# EAGLE design mega_meco (EAGLE 7.5.0)
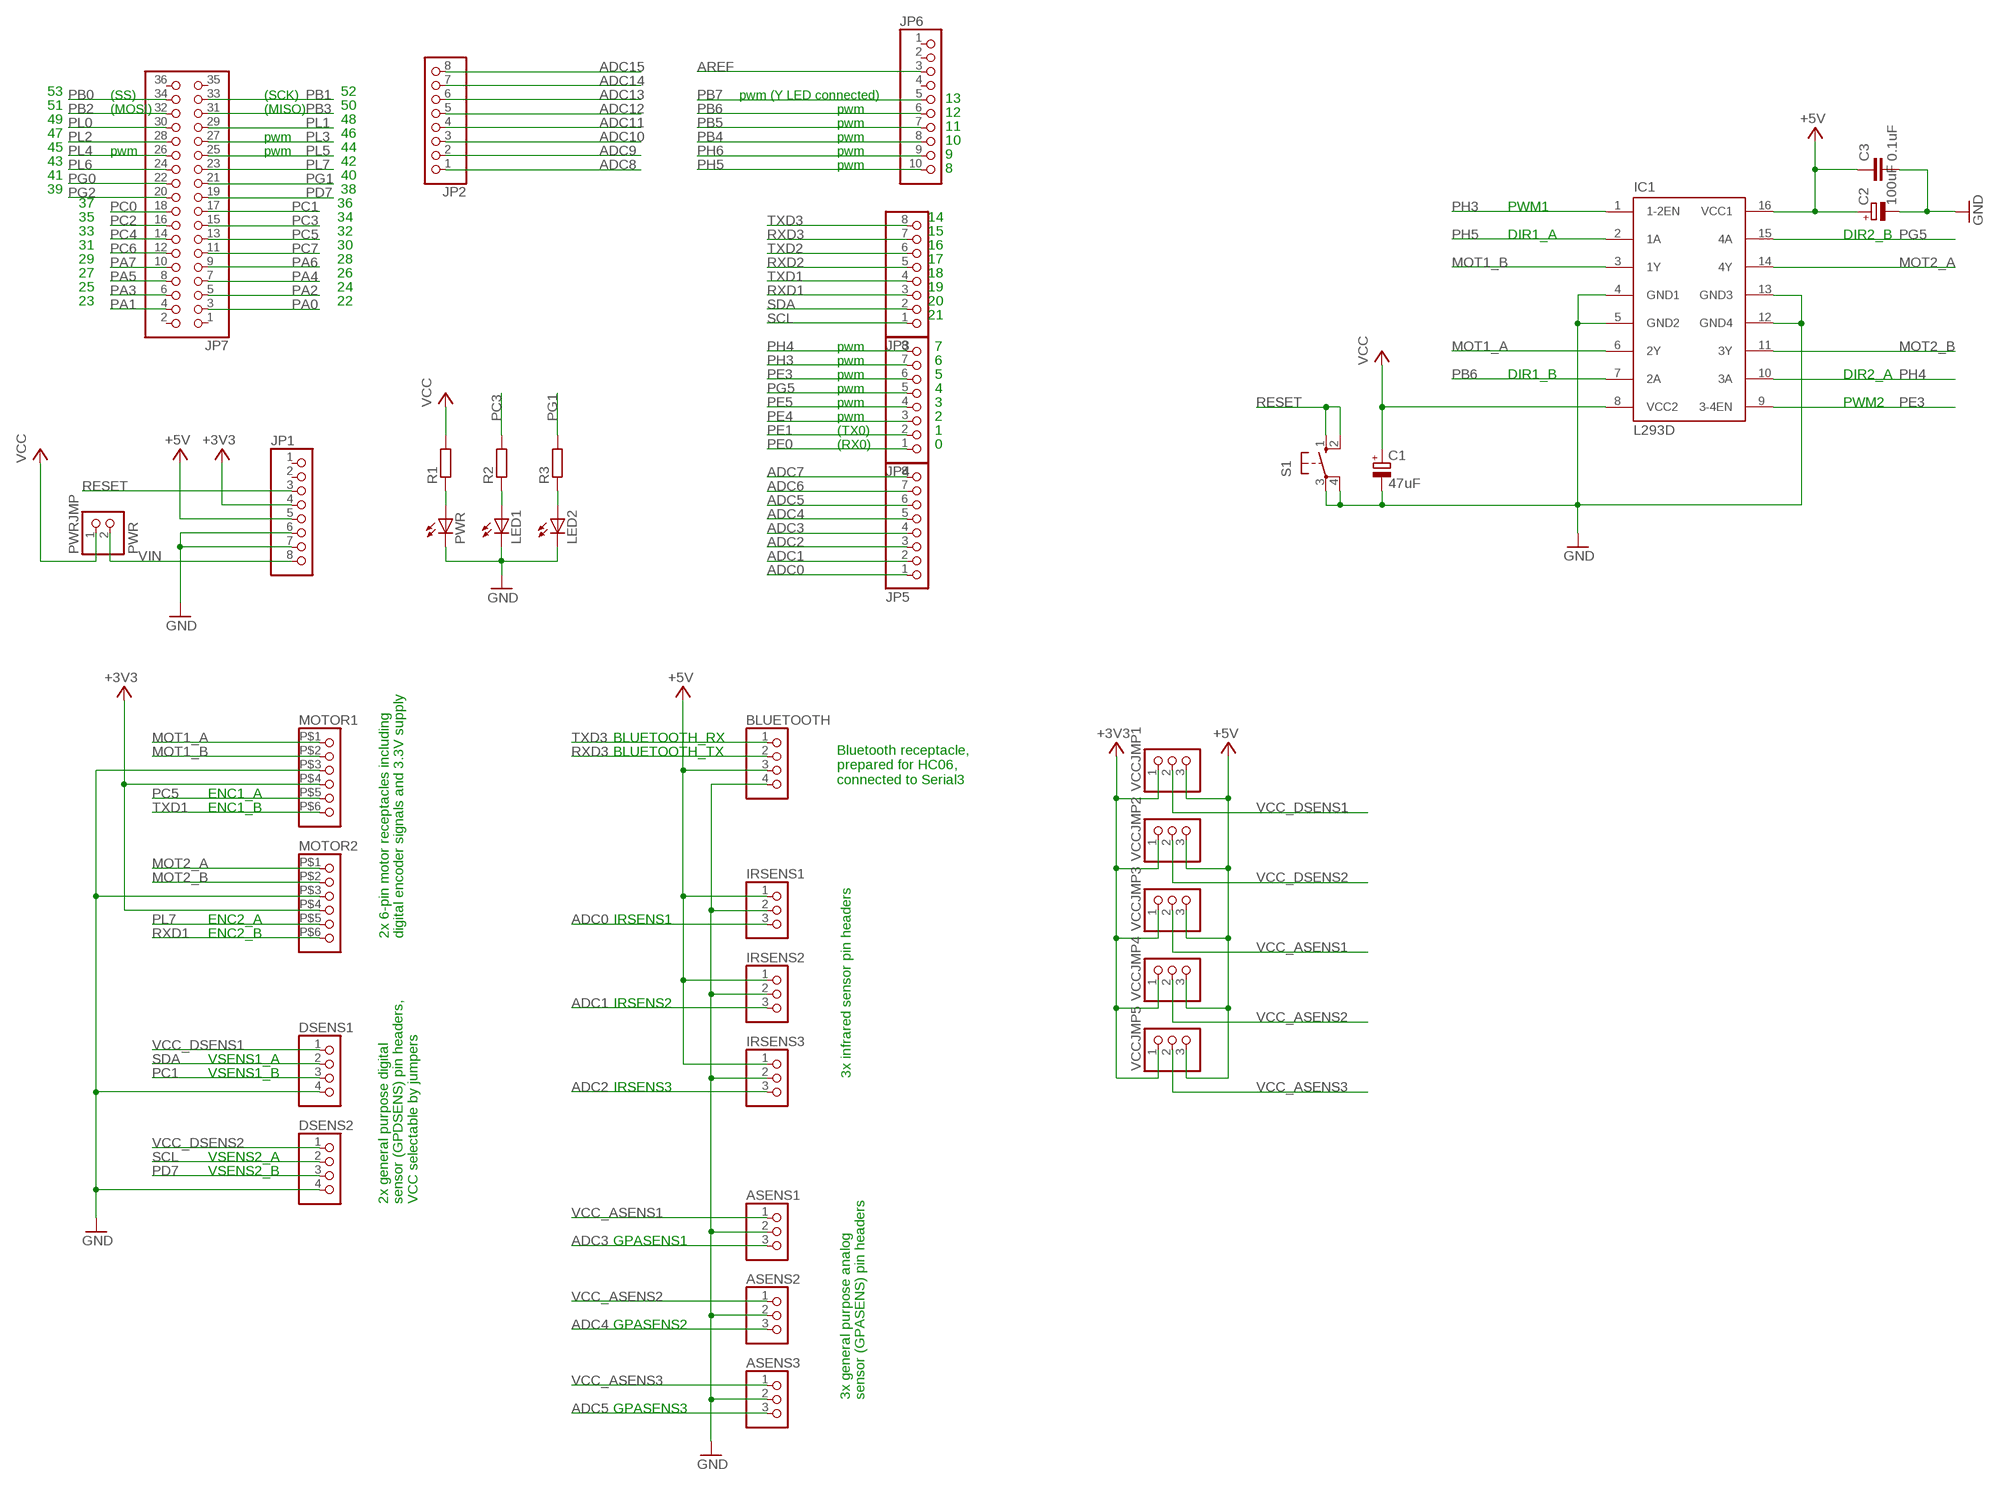
[diagram p0: schematic, sheet 1]

## Parts
ASENS1  PINHD-1X3  [1X03]
ASENS2  PINHD-1X3  [1X03]
ASENS3  PINHD-1X3  [1X03]
BLUETOOTH  PINHD-1X4  [1X04]
C1  47uF  CPOL-EUE2-5  [E2-5]
C2  100uF  CPOL-EUE2-5  [E2-5]
C3  0.1uF  C-EU025-025X050  [C025-025X050]
DSENS1  PINHD-1X4  [1X04]
DSENS2  PINHD-1X4  [1X04]
IC1  L293D  L293E  [DIL16]
IRSENS1  PINHD-1X3  [1X03]
IRSENS2  PINHD-1X3  [1X03]
IRSENS3  PINHD-1X3  [1X03]
JP1  PINHD-1X8  [1X08]
JP2  PINHD-1X8  [1X08]
JP3  PINHD-1X8  [1X08]
JP4  PINHD-1X8  [1X08]
JP5  PINHD-1X8  [1X08]
JP6  PINHD-1X10  [1X10]
JP7  PINHD-2X18  [2X18]
LED1  LED3MM  [LED3MM]
LED2  LED3MM  [LED3MM]
MOTOR1  PINHD-1X6-2.5MM  [1X06-2.5MM]
MOTOR2  PINHD-1X6-2.5MM  [1X06-2.5MM]
PWR  LED5MM  [LED5MM]
PWRJMP  PWR  PINHD-1X2  [1X02]
R1  R-EU_0204/5  [0204/5]
R2  R-EU_0204/5  [0204/5]
R3  R-EU_0204/5  [0204/5]
S1  10-XX  [B3F-10XX]
VCCJMP1  PINHD-1X3  [1X03]
VCCJMP2  PINHD-1X3  [1X03]
VCCJMP3  PINHD-1X3  [1X03]
VCCJMP4  PINHD-1X3  [1X03]
VCCJMP5  PINHD-1X3  [1X03]

## Nets
+3V3 [power]: JP1.4 MOTOR1.P$4 MOTOR2.P$4 VCCJMP1.1 VCCJMP2.1 VCCJMP3.1 VCCJMP4.1 VCCJMP5.1
+5V [power usb]: BLUETOOTH.3 C2.+ C3.1 IC1.16(VCC1) IRSENS1.1 IRSENS2.1 IRSENS3.1 JP1.5 VCCJMP1.3 VCCJMP2.3 VCCJMP3.3 VCCJMP4.3 VCCJMP5.3
ADC0: IRSENS1.3 JP5.1
ADC1: IRSENS2.3 JP5.2
ADC2: IRSENS3.3 JP5.3
ADC3: ASENS1.3 JP5.4
ADC4: ASENS2.3 JP5.5
ADC5: ASENS3.3 JP5.6
ADC6: JP5.7
ADC7: JP5.8
ADC8: JP2.1
ADC9: JP2.2
ADC10: JP2.3
ADC11: JP2.4
ADC12: JP2.5
ADC13: JP2.6
ADC14: JP2.7
ADC15: JP2.8
AREF: JP6.3
GND [gnd]: ASENS1.2 ASENS2.2 ASENS3.2 BLUETOOTH.4 C1.- C2.- C3.2 DSENS1.4 DSENS2.4 IC1.4(GND1) IC1.5(GND2) IC1.12(GND4) IC1.13(GND3) IRSENS1.2 IRSENS2.2 IRSENS3.2 JP1.6 JP1.7 LED1.K(C) LED2.K(C) MOTOR1.P$3 MOTOR2.P$3 PWR.K(C) S1.3(P) S1.4(P1)
MOT1_A: IC1.6(2Y) MOTOR1.P$1
MOT1_B: IC1.3(1Y) MOTOR1.P$2
MOT2_A: IC1.14(4Y) MOTOR2.P$1
MOT2_B: IC1.11(3Y) MOTOR2.P$2
N$1: PWR.A R1.1
N$2: LED1.A R2.1
N$3: LED2.A R3.1
PA0: JP7.3
PA1: JP7.4
PA2: JP7.5
PA3: JP7.6
PA4: JP7.7
PA5: JP7.8
PA6: JP7.9
PA7: JP7.10
PB0: JP7.34
PB1: JP7.33
PB2: JP7.32
PB3: JP7.31
PB4: JP6.8
PB5: JP6.7
PB6: IC1.7(2A) JP6.6
PB7: JP6.5
PC0: JP7.18
PC1: DSENS1.3 JP7.17
PC2: JP7.16
PC3: JP7.15 R2.2
PC4: JP7.14
PC5: JP7.13 MOTOR1.P$5
PC6: JP7.12
PC7: JP7.11
PD7: DSENS2.3 JP7.19
PE0: JP4.1
PE1: JP4.2
PE3: IC1.9(3-4EN) JP4.6
PE4: JP4.3
PE5: JP4.4
PG0: JP7.22
PG1: JP7.21 R3.2
PG2: JP7.20
PG5: IC1.15(4A) JP4.5
PH3: IC1.1(1-2EN) JP4.7
PH4: IC1.10(3A) JP4.8
PH5: IC1.2(1A) JP6.10
PH6: JP6.9
PL0: JP7.30
PL1: JP7.29
PL2: JP7.28
PL3: JP7.27
PL4: JP7.26
PL5: JP7.25
PL6: JP7.24
PL7: JP7.23 MOTOR2.P$5
RESET: JP1.3 S1.1(S) S1.2(S1)
RXD1: JP3.3 MOTOR2.P$6
RXD2: JP3.5
RXD3: BLUETOOTH.2 JP3.7
SCL: DSENS2.2 JP3.1
SDA: DSENS1.2 JP3.2
TXD1: JP3.4 MOTOR1.P$6
TXD2: JP3.6
TXD3: BLUETOOTH.1 JP3.8
VCC [power]: C1.+ IC1.8(VCC2) PWRJMP.1 R1.2
VCC_ASENS1 [power usb]: ASENS1.1 VCCJMP3.2
VCC_ASENS2 [power usb]: ASENS2.1 VCCJMP4.2
VCC_ASENS3 [power usb]: ASENS3.1 VCCJMP5.2
VCC_DSENS1: DSENS1.1 VCCJMP1.2
VCC_DSENS2: DSENS2.1 VCCJMP2.2
VIN [power]: JP1.8 PWRJMP.2
Unconnected: JP1.1 JP1.2 JP6.1 JP6.2 JP6.4 JP7.1 JP7.2 JP7.35 JP7.36

## Notes on the sheet
- 53 | (SS) | (SCK) | 52 | pwm (Y LED connected)
- 13
- 51 | (MOSI) | (MISO) | 50 | pwm
- 12
- 49 | 48 | pwm
- 11
- 47 | pwm | 46 | pwm
- 10
- 45 | pwm | pwm | 44 | pwm
- 9
- 43 | 42 | pwm
- 8
- 41 | 40
- 39 | 38
- 37 | 36 | PWM1
- 35 | 34 | 14
- 33 | 32 | 15 | DIR1_A | DIR2_B
- 31 | 30 | 16
- 29 | 28 | 17
- 27 | 26 | 18
- 25 | 24 | 19
- 23 | 22 | 20
- 21
- pwm | 7
- pwm | 6
- pwm | 5 | DIR1_B | DIR2_A
- pwm | 4
- pwm | 3 | PWM2
- pwm | 2
- (TX0) | 1
- (RX0) | 0
- BLUETOOTH_RX
- BLUETOOTH_TX
- Bluetooth receptacle,
  prepared for HC06,
  connected to Serial3
- ENC1_A
- ENC1_B
- ENC2_A | IRSENS1
- ENC2_B
- 2x 6-pin motor receptacles including
  digital encoder signals and 3.3V supply
- IRSENS2
- VSENS1_A
- VSENS1_B | 3x infrared sensor pin headers
- IRSENS3
- VSENS2_A
- VSENS2_B
- 2x general purpose digital
  sensor (GPDSENS) pin headers,
  VCC selectable by jumpers
- GPASENS1
- GPASENS2
- 3x general purpose analog
  sensor (GPASENS) pin headers
- GPASENS3

## Library data of the parts
ASENS1-ASENS3 IRSENS1-IRSENS3 VCCJMP1-VCCJMP5 = pinhead:PINHD-1X3: PIN HEADER
BLUETOOTH DSENS1 DSENS2 = pinhead:PINHD-1X4: PIN HEADER
C1 C2 = rcl:CPOL-EU: POLARIZED CAPACITOR, European symbol
C3 = rcl:C-EU: CAPACITOR, European symbol
IC1 = texas:L293E: TI DEVICE; MF: Arrow Electronics; MPN: L293E; OC_FARNELL: 1467711; OC_NEWARK: 89K0732
JP1-JP5 = pinhead:PINHD-1X8: PIN HEADER
JP6 = pinhead:PINHD-1X10: PIN HEADER
JP7 = pinhead:PINHD-2X18: PIN HEADER
LED1 LED2 PWR = led:LED: LED OSRAM: - CHIPLED LG R971, LG N971, LY N971, LG Q971, LY Q971, LO R971, LY R971 LH N974, LH R974 LS Q976, LO Q976, LY Q976 LO Q996 - Hyper CHIPLED LW Q18S LB Q993, LB Q99A, LB R99A - SideLED LS A670, LO A670, LY A670, LG A670, LP A670 LB A673, LV A673, LT A673, LW A673 LH A674 LY A675 LS A676, LA A676, LO A676, LY A676, LW A676 LS A679, LY A679, LG A679 - Hyper Micro SIDELED® LS Y876, LA Y876, LO Y876, LY Y876 LT Y87S - SmartLED LW L88C, LW L88S LB L89C, LB L89S, LG L890 LS L89K, LO L89K, LY L89K LS L896, LA L896, LO L896, LY L896 - TOPLED LS T670, LO T670, LY T670, LG T670, LP T670 LSG T670, LSP T670, LSY T670, LOP T670, LYG T670 LG T671, LOG T671, LSG T671 LB T673, LV T673, LT T673, LW T673 LH T674 LS T676, LA T676, LO T676, LY T676, LB T676, LH T676, LSB T676, LW T676 LB T67C, LV T67C, LT T67C, LS T67K, LO T67K, LY T67K, LW E67C LS E67B, LA E67B, LO E67B, LY E67B, LB E67C, LV E67C, LT E67C LW T67C LS T679, LY T679, LG T679 LS T770, LO T770, LY T770, LG T770, LP T770 LB T773, LV T773, LT T773, LW T773 LH T774 LS E675, LA E675, LY E675, LS T675 LS T776, LA T776, LO T776, LY T776, LB T776 LHGB T686 LT T68C, LB T68C - Hyper Mini TOPLED® LB M676 - Mini TOPLED Santana® LG M470 LS M47K, LO M47K, LY M47K Source: http://www.osram.convergy.de LUXEON: - LUMILED® LXK2-PW12-R00, LXK2-PW12-S00, LXK2-PW14-U00, LXK2-PW14-V00 LXK2-PM12-R00, LXK2-PM12-S00, LXK2-PM14-U00 LXK2-PE12-Q00, LXK2-PE12-R00, LXK2-PE12-S00, LXK2-PE14-T00, LXK2-PE14-U00 LXK2-PB12-K00, LXK2-PB12-L00, LXK2-PB12-M00, LXK2-PB14-N00, LXK2-PB14-P00, LXK2-PB14-Q00 LXK2-PR12-L00, LXK2-PR12-M00, LXK2-PR14-Q00, LXK2-PR14-R00 LXK2-PD12-Q00, LXK2-PD12-R00, LXK2-PD12-S00 LXK2-PH12-R00, LXK2-PH12-S00 LXK2-PL12-P00, LXK2-PL12-Q00, LXK2-PL12-R00 Source: www.luxeon.com KINGBRIGHT: KA-3528ASYC Source: www.kingbright.com
MOTOR1 MOTOR2 = pinhead:PINHD-1X6: PIN HEADER
PWRJMP = pinhead:PINHD-1X2: PIN HEADER
R1-R3 = resistor:R-EU_: RESISTOR, European symbol
S1 = switch-omron:10-XX: OMRON SWITCH; MPN: B3F-1000; OC_FARNELL: 176432; OC_NEWARK: 36M3542

## Net classes
0 default: width 0.203 mm, drill 0.406 mm, clearance 0.203 mm
1 power: width 0.61 mm, drill 0.406 mm, clearance 0.203 mm
2 gnd: width 0.305 mm, drill 0.406 mm, clearance 0.203 mm
3 power usb: width 0.508 mm, drill 0.406 mm, clearance 0.203 mm

## Board
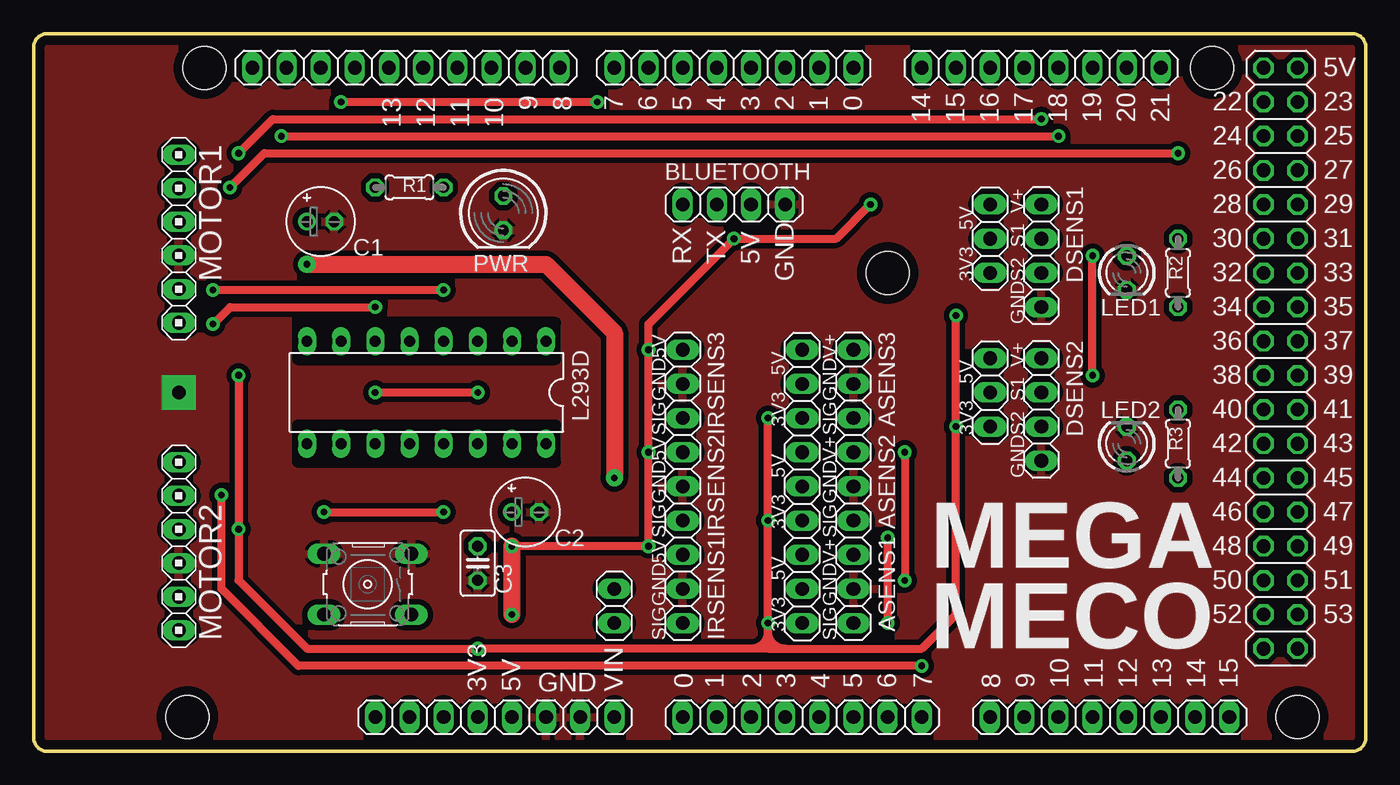
[diagram p1: board, top side]
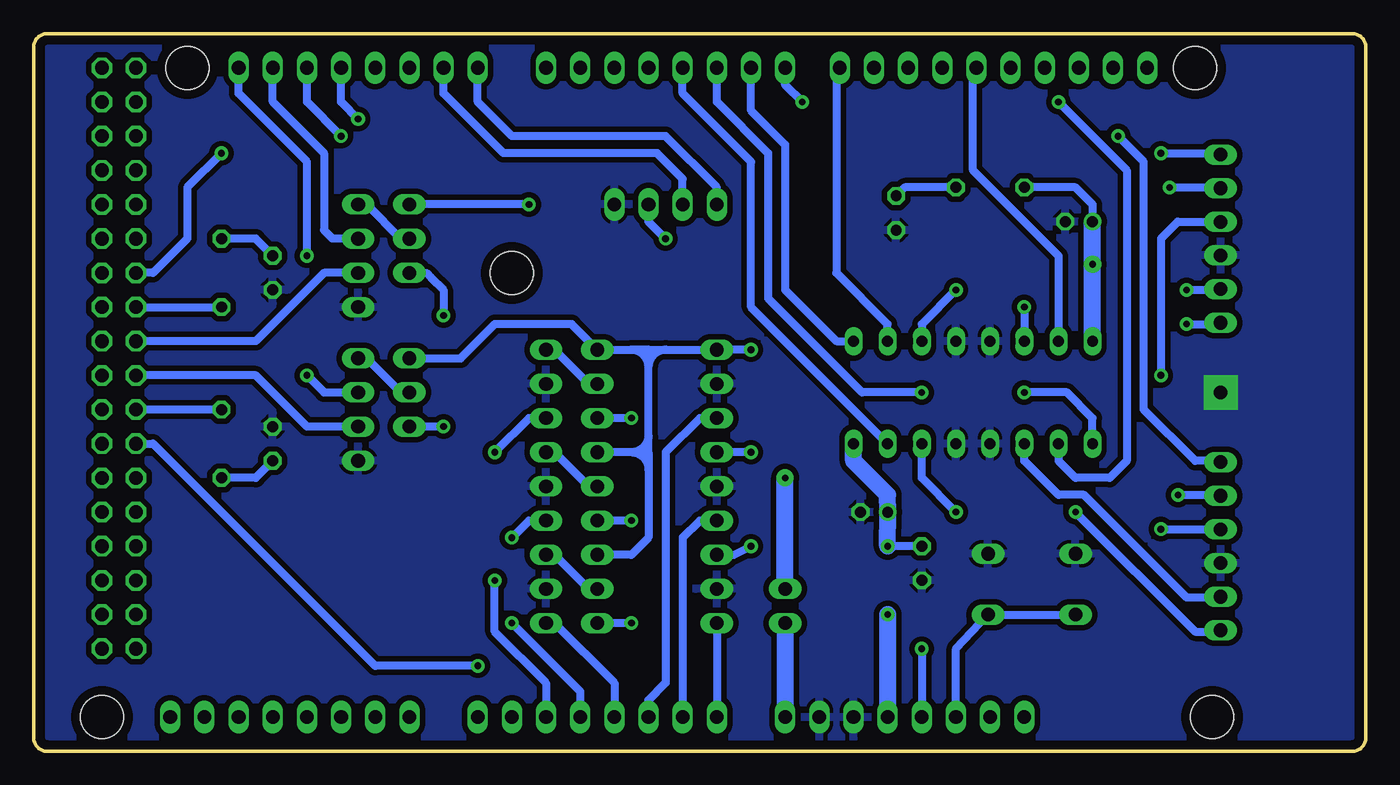
[diagram p2: board, bottom side, seen from below]

Size 99.06 x 53.34 mm. Coordinates in mm from the lower left corner, seen from the top.
Outline: 99.06,52.39 99.06,0.95
Outline: 0,1 arc90 1,0 98.06,0 arc90 99.06,1
Outline: 0,52.34 arc-90 1,53.34 98.11,53.34
Outline: 0,0.95 0,1
Outline: 0,1 0,52.34
Outline: 0,52.34 0,52.39
Outline: 98.06,53.34 arc-90 99.06,52.34
Copper layers (1*16): Top 0.035mm / dielectric 1.5mm / Bottom 0.035mm
Design rules "default *": minimum track width 0.5mm, minimum drill 0.5mm, track to track 0.4mm, track to pad 0.4mm, pad to pad 0.4mm, via to via 0.4mm, smd to smd 7mil, copper to edge 27mil, drill to drill 12mil, minimum pad ring 10mil, minimum via ring 10mil, stop-mask expansion 2mil, vias tented up to drill 24mil, thermal gap 10mil
Holes 3.2 mm at 93.98,2.54 12.7,50.8 87.63,50.8 11.43,2.54 63.5,35.56
tRestrict: area 58.4,18.4 to 59.7,21; area 58.4,26 to 59.7,28.6; area 58.4,10.8 to 59.7,13.3
bRestrict: area 58.4,10.8 to 59.7,13.3; area 58.4,18.4 to 59.7,21; area 58.4,26 to 59.7,28.6

### Footprints (pad centres in the part's own frame; a part is rotated, then mirrored left to right if it is on the bottom)
1X03 = drill 1.016 long: 1 -2.54,0; 2 0,0; 3 2.54,0
1X04 = drill 1.016 long: 1 -3.81,0; 2 -1.27,0; 3 1.27,0; 4 3.81,0
E2-5 = drill 0.813 pad 1.27: + -1.016,0 | drill 0.813 pad 1.27 octagon: - 1.016,0
C025-025X050 = drill 0.813 octagon: 1 -1.27,0; 2 1.27,0
DIL16 = drill 0.813 long: 1 -8.89,-3.81; 2 -6.35,-3.81; 3 -3.81,-3.81; 4 -1.27,-3.81; 5 1.27,-3.81; 6 3.81,-3.81; 7 6.35,-3.81; 8 8.89,-3.81; 9 8.89,3.81; 10 6.35,3.81; 11 3.81,3.81; 12 1.27,3.81; 13 -1.27,3.81; 14 -3.81,3.81; 15 -6.35,3.81; 16 -8.89,3.81
1X08 = drill 1.016 long: 1 -8.89,0; 2 -6.35,0; 3 -3.81,0; 4 -1.27,0; 5 1.27,0; 6 3.81,0; 7 6.35,0; 8 8.89,0
1X10 = drill 1.016 long: 1 -11.43,0; 2 -8.89,0; 3 -6.35,0; 4 -3.81,0; 5 -1.27,0; 6 1.27,0; 7 3.81,0; 8 6.35,0; 9 8.89,0; 10 11.43,0
2X18 = drill 1.016 octagon: 1 -21.59,-1.27; 2 -21.59,1.27; 3 -19.05,-1.27; 4 -19.05,1.27; 5 -16.51,-1.27; 6 -16.51,1.27; 7 -13.97,-1.27; 8 -13.97,1.27; 9 -11.43,-1.27; 10 -11.43,1.27; 11 -8.89,-1.27; 12 -8.89,1.27; 13 -6.35,-1.27; 14 -6.35,1.27; 15 -3.81,-1.27; 16 -3.81,1.27; 17 -1.27,-1.27; 18 -1.27,1.27; 19 1.27,-1.27; 20 1.27,1.27; 21 3.81,-1.27; 22 3.81,1.27; 23 6.35,-1.27; 24 6.35,1.27; 25 8.89,-1.27; 26 8.89,1.27; 27 11.43,-1.27; 28 11.43,1.27; 29 13.97,-1.27; 30 13.97,1.27; 31 16.51,-1.27; 32 16.51,1.27; 33 19.05,-1.27; 34 19.05,1.27; 35 21.59,-1.27; 36 21.59,1.27
LED3MM = drill 0.813 octagon: A -1.27,0; K 1.27,0
1X06-2.5MM = drill 1.016 long: P$1 -6.25,0; P$2 -3.75,0; P$3 -1.25,0; P$4 1.25,0; P$5 3.75,0; P$6 6.25,0
LED5MM = drill 0.813 octagon: A -1.27,0; K 1.27,0
1X02 = drill 1.016 long: 1 -1.27,0; 2 1.27,0
0204/5 = drill 0.813 octagon: 1 -2.54,0; 2 2.54,0
B3F-10XX = drill 1.016 long: 1 -3.251,2.261; 2 3.251,2.261; 3 -3.251,-2.261; 4 3.251,-2.261

### Placement (x,y rotation side)
ASENS1  60.96,12.06 270 top
ASENS2  60.96,19.68 270 top
ASENS3  60.96,27.3 270 top
BLUETOOTH  52.07,40.64 0 top
C1  21.34,39.37 0 top
C2  36.57,17.78 0 top
C3  33.02,13.97 270 top
DSENS1  74.93,36.83 270 top
DSENS2  74.93,25.4 270 top
IC1  29.21,26.67 180 top
IRSENS1  48.26,12.06 270 top
IRSENS2  48.26,19.68 270 top
IRSENS3  48.26,27.3 270 top
JP1  34.29,2.54 0 top
JP2  80.01,2.54 0 top
JP3  74.93,50.8 180 top
JP4  52.07,50.8 180 top
JP5  57.15,2.54 0 top
JP6  27.69,50.8 0 top
JP7  92.71,29.21 270 top
LED1  81.28,35.56 270 top
LED2  81.28,22.86 90 top
MOTOR1  10.79,38.1 90 top
MOTOR2  10.79,15.24 90 top
PWR  34.92,40.01 270 top
PWRJMP  43.18,10.79 270 top
R1  27.94,41.91 180 top
R2  85.09,35.56 270 top
R3  85.09,22.86 90 top
S1  24.84,12.42 180 top
VCCJMP1  71.12,38.1 90 top
VCCJMP2  71.12,26.67 90 top
VCCJMP3  57.15,12.06 90 top
VCCJMP4  57.15,19.68 90 top
VCCJMP5  57.15,27.3 90 top

### Tracks (layer width: path | path; a pad name or v marks a point on that pad's centre or on a via)
+3V3  (via drill 0.5)
  Top 0.6: 55.88,7.62 66.04,7.62 68.58,10.16 v68.58,24.13 v68.58,32.38 | 54.61,7.62 54.61,8.89 | 54.61,8.89 v54.61,9.53 v54.61,17.14 v54.61,24.77 | 54.61,7.62 53.34,7.62 | 53.34,7.62 v33.02,7.62 | v15.24,27.94 v15.24,16.51 15.24,12.7 20.32,7.62 | 54.61,8.89 arc-90 53.34,7.62 | 54.61,7.62 55.88,7.62 | 55.88,7.62 arc-90 54.61,8.89
  Top 0.61: 20.32,7.62 v33.02,7.62
  Bottom 0.6: 69.53,35.24 68.58,34.29 v68.58,32.38 | v33.02,7.62 JP1.4 | v15.24,16.51 11.43,16.51 MOTOR2.P$4 | v15.24,27.94 15.24,38.1 13.99,39.37 10.81,39.37 MOTOR1.P$4
  Bottom 0.61: v54.61,24.77 VCCJMP5.1 | v54.61,17.14 VCCJMP4.1 | v54.61,9.53 VCCJMP3.1 | v68.58,24.13 VCCJMP2.1 | VCCJMP1.1 69.85,35.56 69.53,35.24
+5V  (via drill 0.5)
  Top 0.6: v62.23,40.64 59.69,38.1 v52.07,38.1 45.72,31.75 v45.72,29.84 v45.72,22.23 v45.72,15.24 v35.56,15.24
  Top 1.27: v35.56,10.16 v35.56,15.24
  Bottom 0.6: v45.72,22.23 IRSENS2.1 | 54.61,22.23 53.34,22.23 | v52.07,38.1 53.34,39.37 BLUETOOTH.3 | 53.34,23.5 53.34,28.57 | 53.34,28.57 53.34,29.84 | 53.34,29.84 54.61,29.84 arc90 53.34,28.57 | 53.34,29.84 52.07,29.84 | 52.07,29.84 IRSENS3.1 v45.72,29.84 | 53.34,22.23 53.34,20.95 | 53.34,20.95 53.34,15.88 54.61,14.61 | 52.07,29.84 arc-90 53.34,28.57 | 54.61,22.23 arc90 53.34,20.95 | 53.34,22.23 53.34,23.5 | 53.34,23.5 arc90 54.61,22.23 | IRSENS1.1 46.99,14.61 v45.72,15.24 | C3.1 v35.56,15.24
  Bottom 0.61: 54.61,29.84 VCCJMP5.3 59.05,31.75 64.77,31.75 67.31,29.21 VCCJMP2.3 | 54.61,22.23 VCCJMP4.3 | 54.61,14.61 VCCJMP3.3 | v62.23,40.64 VCCJMP1.3
  Bottom 1.27: v35.56,15.24 C2.+ 35.56,19.05 38.1,21.59 IC1.16 | v35.56,10.16 JP1.5
ADC0
  Bottom 0.6: IRSENS1.3 JP5.1
ADC1
  Bottom 0.6: IRSENS2.3 49.53,17.14 50.8,15.88 JP5.2
ADC2
  Bottom 0.6: IRSENS3.3 49.53,24.77 52.07,22.23 52.07,5.08 53.34,3.81 JP5.3
ADC3
  Bottom 0.6: ASENS1.3 60.33,9.53 55.88,5.08 JP5.4
ADC4  (via drill 0.5)
  Top 0.6: v63.5,15.88 v63.5,9.53
  Bottom 0.6: v63.5,15.88 62.23,17.14 ASENS2.3 | v63.5,9.53 58.42,4.45 JP5.5
ADC5  (via drill 0.5)
  Top 0.6: v64.77,22.23 v64.77,12.7
  Bottom 0.6: ASENS3.3 62.23,24.77 v64.77,22.23 | JP5.6 60.96,5.08 64.77,8.89 v64.77,12.7
GND  (via drill 1.02 pad 2.54)
  other vias: 10.79,26.67
  pour Bottom (isolate 0.4): -5.71,55.88 111.12,56.52 111.12,-4.45 -7.62,-3.17
  pour Top (isolate 0.4): -4.45,54.61 112.39,55.24 112.39,-5.71 -6.35,-4.45
MOT1_A  (via drill 0.5)
  Top 0.6: v25.4,33.02 14.61,33.02 v13.34,31.75
  Bottom 0.6: v25.4,33.02 IC1.6 | v13.34,31.75 11.53,31.75 MOTOR1.P$1
MOT1_B  (via drill 0.5)
  Top 0.6: v13.34,34.29 v30.48,34.29
  Bottom 0.6: v30.48,34.29 33.02,31.75 IC1.3 | v13.34,34.29 10.86,34.29 MOTOR1.P$2
MOT2_A  (via drill 0.5)
  Top 0.6: v21.59,17.78 v30.48,17.78
  Bottom 0.6: v21.59,17.78 12.7,8.89 11.43,8.89 MOTOR2.P$1 | v30.48,17.78 33.02,20.32 IC1.14
MOT2_B
  Bottom 0.6: IC1.11 25.4,21.59 22.86,19.05 20.95,19.05 13.34,11.43 11.43,11.43 MOTOR2.P$2
N$1
  Bottom 0.61: R1.1 34.29,41.91 PWR.A
N$2
  Bottom 0.6: LED1.A 82.55,38.1 R2.1
N$3
  Bottom 0.6: LED2.A 82.55,20.32 R3.1
PB6
  Bottom 0.6: JP6.6 29.21,50.55 29.21,43.18 22.86,36.83 IC1.7
PC1
  Bottom 0.6: DSENS1.3 77.47,35.56 82.55,30.48 JP7.17
PC3
  Bottom 0.6: JP7.15 R2.2
PC5  (via drill 0.5)
  Top 0.6: v85.09,44.45 17.14,44.45 v14.61,41.91
  Bottom 0.6: v14.61,41.91 11.49,41.91 MOTOR1.P$5 | v85.09,44.45 87.63,41.91 87.63,38.1 90.17,35.56 JP7.13
PD7
  Bottom 0.6: DSENS2.3 78.74,24.13 82.55,27.94 JP7.19
PE3  (via drill 0.5)
  Top 0.6: v25.4,26.67 v33.02,26.67
  Bottom 0.6: IC1.9 20.32,24.77 22.23,26.67 v25.4,26.67 | v33.02,26.67 37.47,26.67 44.45,33.66 44.45,44.45 48.26,48.26 JP4.6
PG1
  Bottom 0.6: R3.2 JP7.21
PG5
  Bottom 0.6: IC1.15 45.72,33.02 45.72,43.81 50.8,48.9 JP4.5
PH3
  Bottom 0.6: IC1.1 39.37,30.48 43.18,34.29 43.18,45.09 45.72,47.62 JP4.7
PH4  (via drill 0.5)
  Top 0.6: v22.86,48.26 v41.91,48.26
  Bottom 0.6: v22.86,48.26 17.78,43.18 17.78,21.59 19.05,20.32 21.59,20.32 22.86,21.59 IC1.10 | v41.91,48.26 43.18,49.53 JP4.8
PH5
  Bottom 0.6: IC1.2 35.56,31.75 39.37,35.56 39.37,50.55 JP6.10
PL7  (via drill 0.5)
  Top 0.6: v66.04,6.35 19.68,6.35 13.97,12.06 v13.97,19.05
  Bottom 0.6: JP7.23 90.17,22.86 73.66,6.35 v66.04,6.35 | v13.97,19.05 10.86,19.05 MOTOR2.P$5
RESET
  Bottom 0.6: JP1.3 30.48,7.62 S1.1 S1.2
RXD1  (via drill 0.5)
  Top 0.6: v18.41,45.72 v76.2,45.72
  Bottom 0.6: v76.2,45.72 78.74,48.26 JP3.3 | v18.41,45.72 16.51,43.81 16.51,25.4 12.7,21.59 11.43,21.59 MOTOR2.P$6
RXD3
  Bottom 0.6: JP3.7 68.58,48.9 64.14,44.45 52.7,44.45 50.8,42.55 BLUETOOTH.2
SCL  (via drill 0.5)
  Top 0.6: v78.74,27.94 v78.74,36.83
  Bottom 0.6: v78.74,27.94 77.47,26.67 DSENS2.2 | v78.74,36.83 78.74,43.81 83.82,48.9 JP3.1
SDA
  Bottom 0.6: DSENS1.2 76.83,38.1 77.47,38.73 77.47,44.45 81.28,48.26 JP3.2
TXD1  (via drill 0.5)
  Top 0.6: v74.93,46.99 17.78,46.99 v15.24,44.45
  Bottom 0.6: v74.93,46.99 76.2,48.26 JP3.4 | v15.24,44.45 11.53,44.45 MOTOR1.P$6
TXD3
  Bottom 0.6: JP3.8 66.04,48.26 63.5,45.72 52.07,45.72 48.26,41.91 BLUETOOTH.1
VCC  (via drill 0.5 pad 1.27)
  Top 1.27: v20.32,36.2 38.1,36.2 43.18,31.11 v43.18,20.32
  Bottom 0.6: C1.+ 20.32,40.64 21.59,41.91 R1.2
  Bottom 1.27: C1.+ v20.32,36.2 IC1.8 | PWRJMP.1 v43.18,20.32
VCC_ASENS1
  Bottom 0.6: 57.78,12.06 60.33,14.61 ASENS1.1
  Bottom 0.61: 57.78,12.06 VCCJMP3.2
VCC_ASENS2
  Bottom 0.6: 57.78,19.68 60.33,22.23 ASENS2.1
  Bottom 0.61: VCCJMP4.2 57.78,19.68
VCC_ASENS3
  Bottom 0.6: ASENS3.1 60.33,29.84 57.78,27.3
  Bottom 0.61: 57.78,27.3 VCCJMP5.2
VCC_DSENS1
  Bottom 0.6: 71.75,38.1 74.3,40.64 DSENS1.1
  Bottom 0.61: 71.75,38.1 VCCJMP1.2
VCC_DSENS2
  Bottom 0.6: 71.75,26.67 74.3,29.21 DSENS2.1
  Bottom 0.61: VCCJMP2.2 71.75,26.67
VIN
  Bottom 1.27: PWRJMP.2 JP1.8

### Text on the board
tPlace: 5V | 9 | 8 | 7 | 6 | 5 | 4 | 3 | 2 | 1 | 0 | 22 | 23 | 14 | 15 | 16 | 17 | 18 | 19 | 20 | 21 | 13 | 12 | 11 | 10 | 24 | 25 | 26 | 27 | 28 | 29 | 30 | 31 | RX | TX | 5V | GND | 32 | 33 | 34 | 35 | 36 | 37 | 38 | 39 | 40 | 41 | 42 | 43 | 44 | 45 | 46 | 47 | 48 | 49 | 50 | 51 | 52 | 53 | MEGA / MECO | 0 | 1 | 2 | 3 | 4 | 5 | 6 | 7 | 8 | 9 | 10 | 11 | 12 | 13 | 14 | 15
tNames: V+ | 5V | S1 | 3V3 | S2 | GND | 5V | V+ | V+ | 5V | 5V | GND | GND | S1 | 3V3 | SIG | SIG | 3V3 | S2 | 5V | V+ | 5V | GND | GND | GND | 3V3 | SIG | SIG | 5V | V+ | 5V | GND | GND | 3V3 | SIG | SIG | 3V3 | 5V | GND | VIN